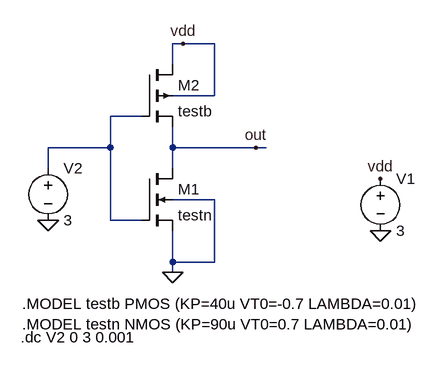
[diagram p0: schematic inverter.asc]
inverter.asc, the LTspice schematic file:
Version 4
SHEET 1 880 680
WIRE 208 -144 192 -144
WIRE 256 -144 208 -144
WIRE 192 -112 192 -144
WIRE 256 -64 256 -144
WIRE 256 -64 192 -64
WIRE 144 -32 96 -32
WIRE 96 16 96 -32
WIRE 96 16 0 16
WIRE 192 16 192 -16
WIRE 320 16 192 16
WIRE 336 16 320 16
WIRE 0 48 0 16
WIRE 192 48 192 16
WIRE 256 96 192 96
WIRE 96 128 96 16
WIRE 144 128 96 128
WIRE 192 192 192 144
WIRE 256 192 256 96
WIRE 256 192 192 192
WIRE 192 208 192 192
FLAG 320 16 out
FLAG 192 208 0
FLAG 208 -144 vdd
FLAG 512 144 0
FLAG 512 64 vdd
FLAG 0 128 0
SYMBOL nmos4 144 48 R0
SYMATTR InstName M1
SYMATTR Value testn
SYMBOL pmos4 144 -112 R0
SYMATTR InstName M2
SYMATTR Value testb
SYMBOL voltage 512 48 R0
WINDOW 123 0 0 Left 0
WINDOW 39 0 0 Left 0
SYMATTR InstName V1
SYMATTR Value 3
SYMBOL voltage 0 32 R0
WINDOW 123 0 0 Left 0
WINDOW 39 0 0 Left 0
SYMATTR InstName V2
SYMATTR Value 3
TEXT -40 256 Left 2 !.MODEL testb PMOS (KP=40u VT0=-0.7 LAMBDA=0.01)
TEXT -40 288 Left 2 !.MODEL testn NMOS (KP=90u VT0=0.7 LAMBDA=0.01)
TEXT -42 308 Left 2 !.dc V2 0 3 0.001

The netlist it stands for:
* inverter.asc
M1 out N001 0 0 testn
M2 vdd N001 out vdd testb
V1 vdd 0 3
V2 N001 0 3
.model NMOS NMOS
.model PMOS PMOS
.lib standard.mos
.MODEL testb PMOS (KP=40u VT0=-0.7 LAMBDA=0.01)
.MODEL testn NMOS (KP=90u VT0=0.7 LAMBDA=0.01)
.dc V2 0 3 0.001
.backanno
.end